# EAGLE board Beta24_mix (EAGLE 9.4.2)
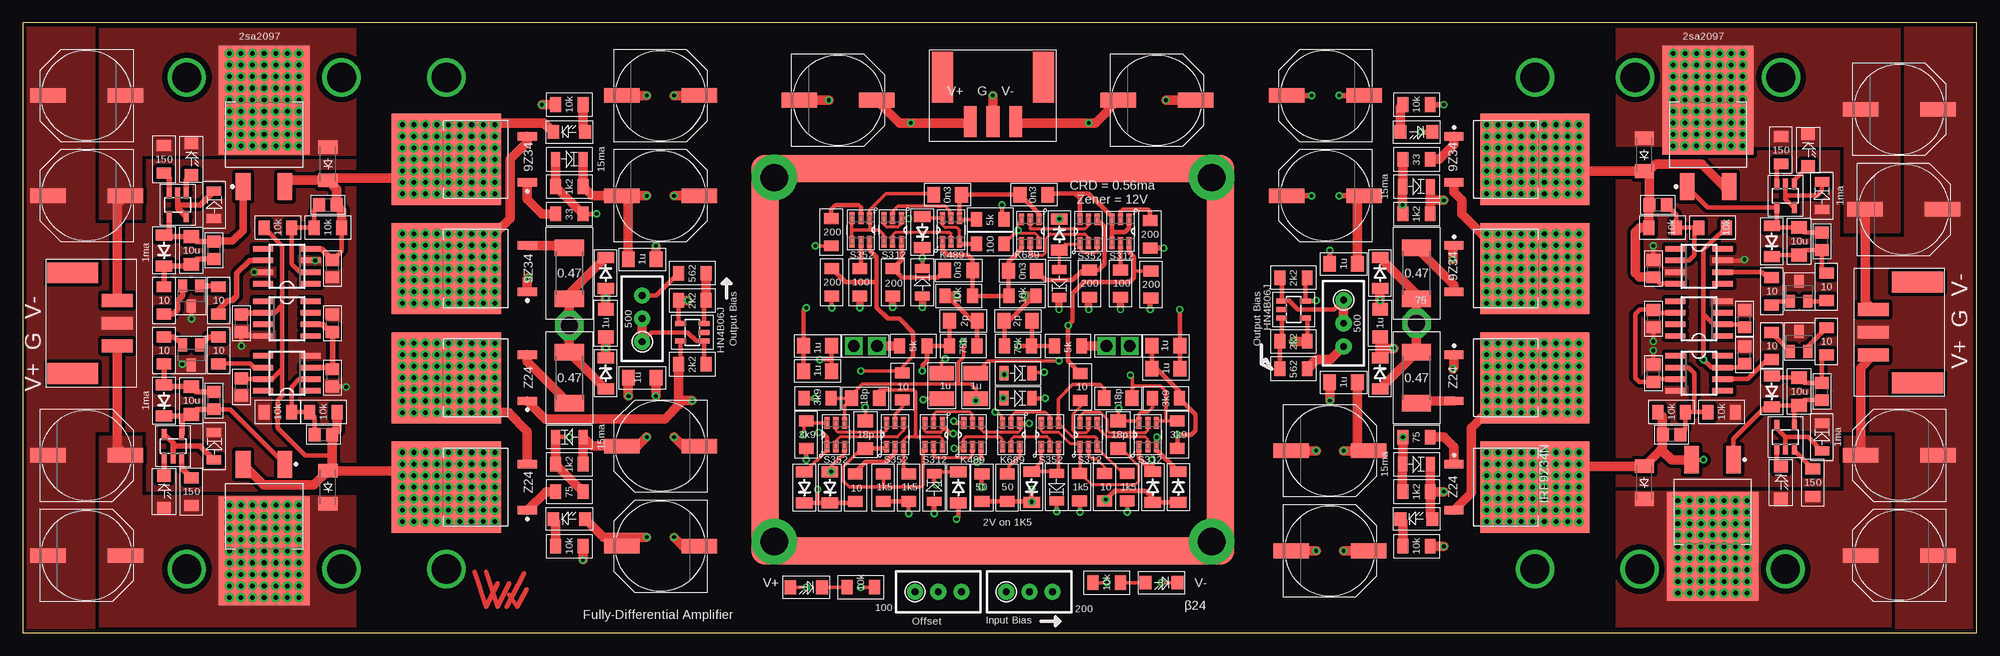
[diagram p2: board, top side]
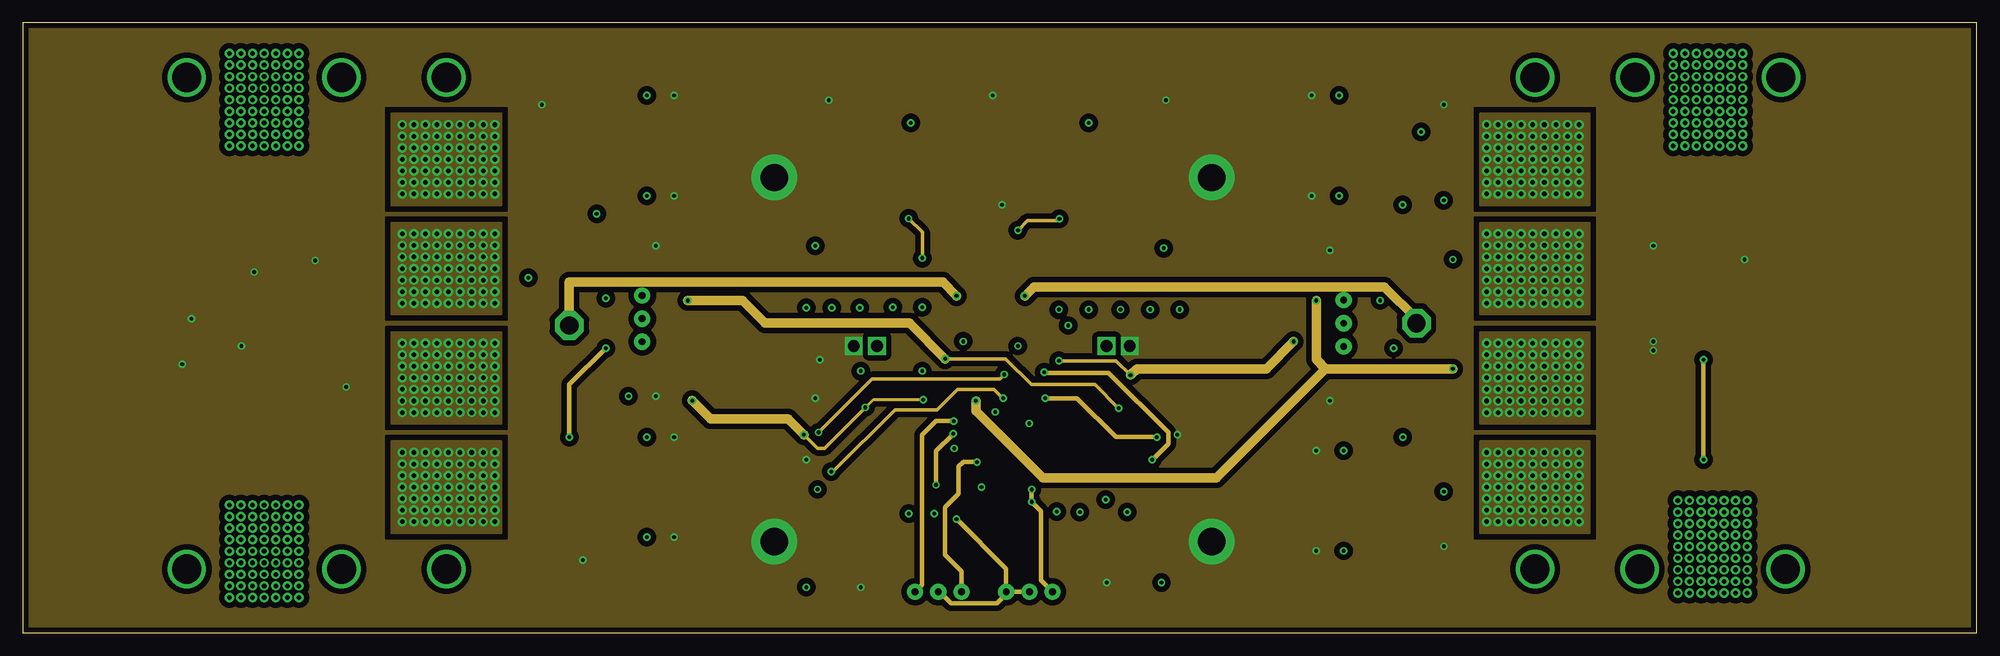
[diagram p3: board, inner layer Route2]
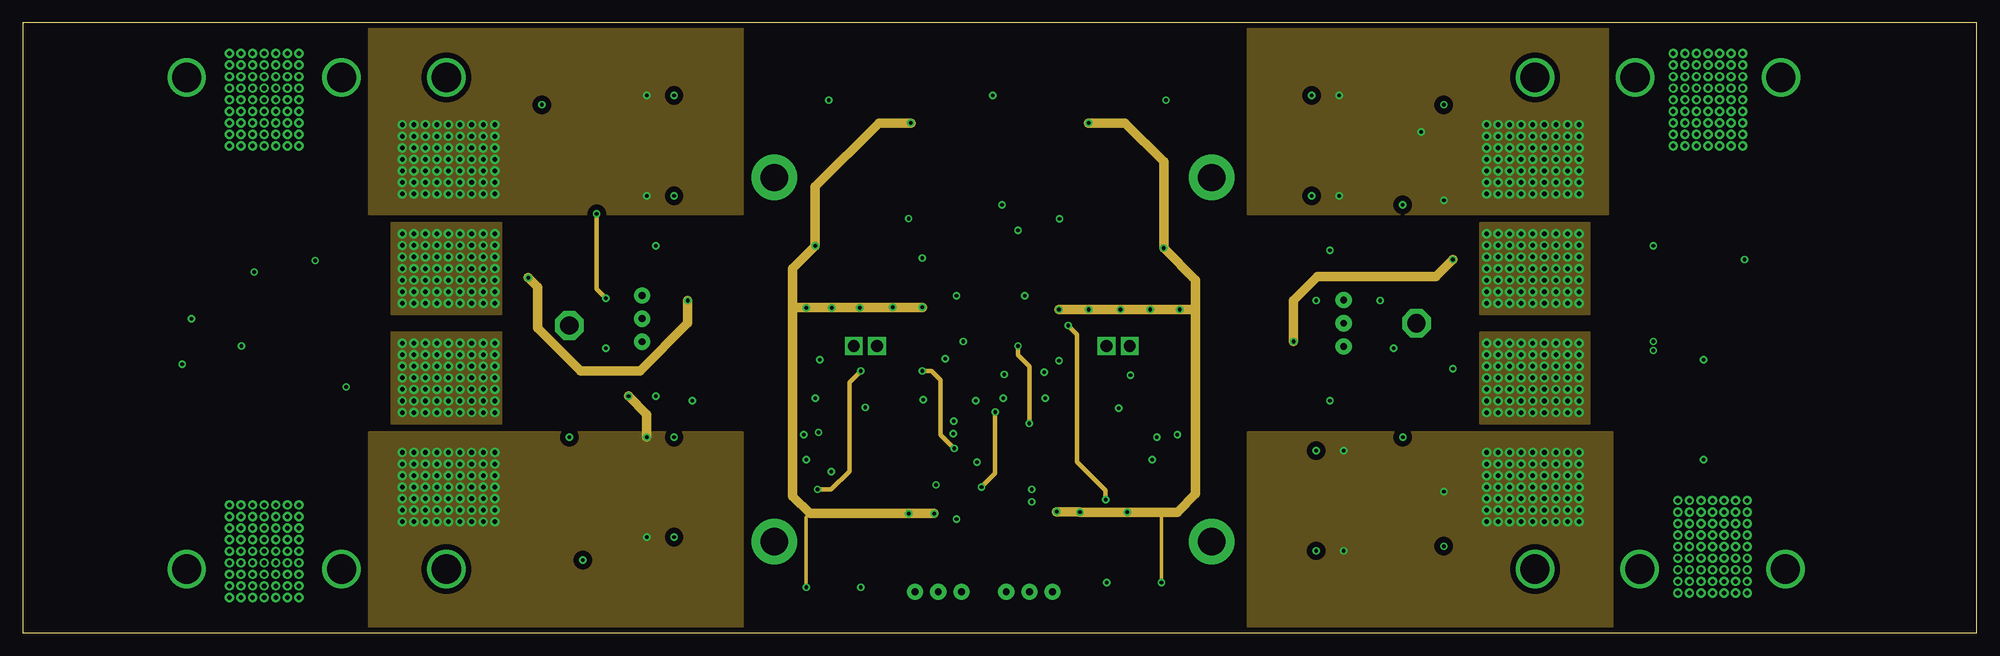
[diagram p4: board, inner layer Route15]
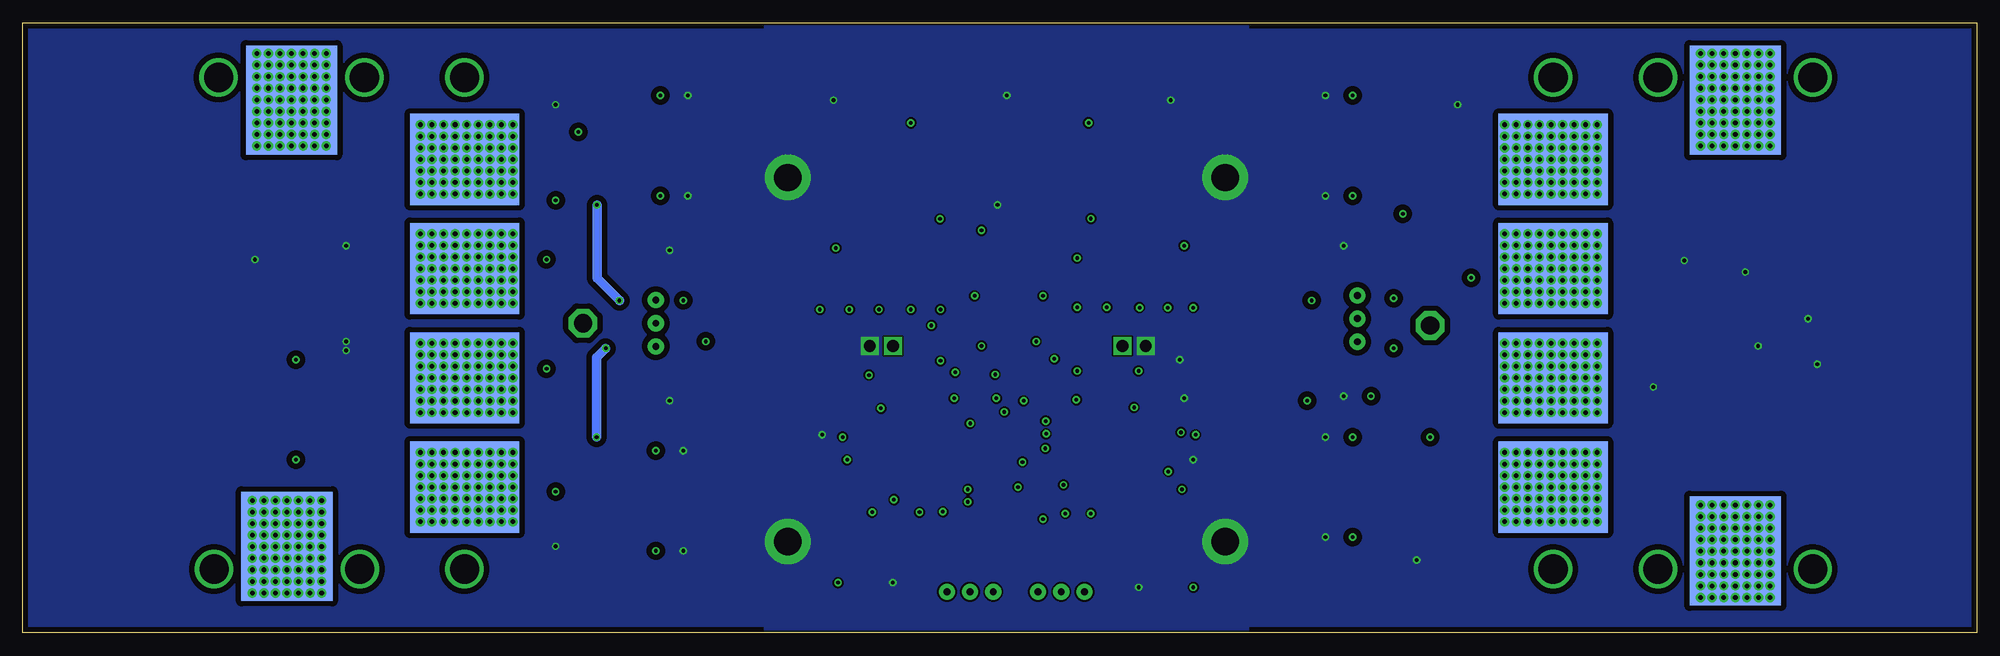
[diagram p5: board, bottom side, seen from below]

Size 214.5 x 67 mm. Coordinates in mm from the lower left corner, seen from the top.
Outline: 0,0 214.5,0 214.5,67 0,67 0,0
Copper layers (1+2*15+16): Top 0.035mm / dielectric 1.5mm / Route2 0.035mm / dielectric 0.15mm / Route15 0.035mm / dielectric 0.2mm / Bottom 0.035mm
Design rules "default *": minimum track width 10mil, minimum drill 0.4mm, track to track 8mil, track to pad 8mil, pad to pad 8mil, via to via 8mil, smd to smd 8mil, copper to edge 10mil, drill to drill 10mil, minimum pad ring 10mil, minimum via ring 8mil, stop-mask expansion 4mil, vias tented up to drill 0.4mm, thermal gap 15mil

## Footprints (pad centres in the part's own frame; a part is rotated, then mirrored left to right if it is on the bottom)
C1206 = smd 1.4 x 1.7: 1 -1.527,0; 2 1.527,0
C1210 = smd 1.6 x 2.7: 1 -1.4,0; 2 1.4,0
PANASONIC_G = smd 3.9 x 1.6: + 4.25,0; - -4.25,0
C0805 = smd 1.3 x 1.5: 1 -0.95,0; 2 0.95,0
SMD = smd 1 x 1.6: ANODE 1.525,0; CATHODE -1.525,0
SOD80C = smd 1.2 x 1.8: A 1.7,0; C -1.7,0
LED_SML1206 = smd 1.3 x 1.5: A 1.75,0; C -1.75,0
SOD-123_MINI-SMA = smd 1.5 x 2.1: A 1.8,0; C -1.8,0
SOIC8 = smd 0.6 x 2.2: 1 -1.905,-2.6; 2 -0.635,-2.6; 3 0.635,-2.6; 4 1.905,-2.6; 5 1.905,2.6; 6 0.635,2.6; 7 -0.635,2.6; 8 -1.905,2.6
TRANSISTOR_SOT23-BEC = smd 1 x 1.4: B -0.95,-1.1; C 0,1.1; E 0.95,-1.1
TO254P1054X240-3M = smd 2.108 x 0.925: 1 -8.887,2.54; 3 -8.887,-2.54 | smd 12 x 10 bottom: 2 0,0 | smd 12 x 10: 4 0,0 | drill 0.5 pad 1.016: P$1 -4.045,2.54; P$2 -2.775,2.54; P$3 -1.505,2.54; P$4 -0.235,2.54; P$5 1.035,2.54; P$6 2.305,2.54; P$7 3.575,2.54; P$8 3.575,1.27; P$9 2.305,1.27; P$10 -0.235,1.27; P$11 1.035,1.27; P$12 -1.505,1.27; P$13 -2.775,1.27; P$14 -4.045,1.27; P$15 -4.045,0; P$16 -2.775,0; P$17 -1.505,0; P$18 -0.235,0; P$19 1.035,0; P$20 2.305,0; P$21 3.575,0; P$22 3.575,-1.27; P$23 2.305,-1.27; P$24 1.035,-1.27; P$25 -0.235,-1.27; P$26 -1.505,-1.27; P$27 -2.775,-1.27; P$28 -4.045,-1.27; P$29 -4.045,-2.54; P$30 -2.775,-2.54; P$31 -1.505,-2.54; P$32 -0.235,-2.54; P$33 1.035,-2.54; P$34 2.305,-2.54; P$35 3.575,-2.54; P$36 3.575,-3.81; P$37 2.305,-3.81; P$38 1.035,-3.81; P$39 -0.235,-3.81; P$40 -2.775,-3.81; P$41 -4.045,-3.81; P$42 -1.505,-3.81; P$43 -4.045,3.81; P$44 -2.775,3.81; P$45 -1.505,3.81; P$46 -0.235,3.81; P$47 1.035,3.81; P$48 2.305,3.81; P$49 3.575,3.81; P$50 4.845,3.81; P$51 4.845,2.54; P$52 4.845,1.27; P$53 4.845,0; P$54 4.845,-1.27; P$55 4.845,-2.54; P$56 4.845,-3.81; P$57 -5.315,3.81; P$58 -5.315,2.54; P$59 -5.315,1.27; P$60 -5.315,0; P$61 -5.315,-1.27; P$62 -5.315,-2.54; P$63 -5.315,-3.81
MINI_MELF-0204W = smd 1.2 x 1.6: 1 -1.5,0; 2 1.5,0
R2512 = smd 1.8 x 3.2: 1 -2.8,0; 2 2.8,0
B24J = drill 1.3 square: P$1 -1.27,0; P$2 1.27,0
P1-20 = drill 2.007 pad 3.15 octagon: TP 0,0
SOT-23-6 = smd 1.27 x 0.559: 1 -1.295,0.95; 2 -1.295,0; 3 -1.295,-0.95; 4 1.295,-0.95; 5 1.295,0; 6 1.295,0.95
SOT25 = smd 0.55 x 1.2: 1 -0.95,-1.3; 2 0,-1.3; 3 0.95,-1.3; 4 0.95,1.3; 5 -0.95,1.3
B24C = drill 3 pad 5: P$1 -24,20; P$2 24,20; P$3 24,-20; P$4 -24,-20 | smd 53 x 3: P$5 0,21; P$6 0,-21 | smd 3 x 45: P$7 -25,0; P$8 25,0
CON-PTSM-3 = smd 2.3 x 5.6: P$1 -5.54,0; P$2 5.54,0 | smd 1.4 x 3.4: P$3 -2.5,-4.85; P$4 0,-4.85; P$5 2.5,-4.85
NEW-PWMOLD = smd 3 x 1.6: 1 0.003,2.3; 3 0.003,-2.3 | smd 12 x 10 bottom: 2 9.5,0 | smd 12 x 10: 4 9.5,0 | drill 0.5 pad 1.016: P$1 5.734,2.54; P$2 7.004,2.54; P$3 8.274,2.54; P$4 9.544,2.54; P$5 10.814,2.54; P$6 12.084,2.54; P$7 13.354,2.54; P$8 13.354,1.27; P$9 12.084,1.27; P$10 9.544,1.27; P$11 10.814,1.27; P$12 8.274,1.27; P$13 7.004,1.27; P$14 5.734,1.27; P$15 5.734,0; P$16 7.004,0; P$17 8.274,0; P$18 9.544,0; P$19 10.814,0; P$20 12.084,0; P$21 13.354,0; P$22 13.354,-1.27; P$23 12.084,-1.27; P$24 10.814,-1.27; P$25 9.544,-1.27; P$26 8.274,-1.27; P$27 7.004,-1.27; P$28 5.734,-1.27; P$29 5.734,-2.54; P$30 7.004,-2.54; P$31 8.274,-2.54; P$32 9.544,-2.54; P$33 10.814,-2.54; P$34 12.084,-2.54; P$35 13.354,-2.54; P$36 13.354,-3.81; P$37 12.084,-3.81; P$38 10.814,-3.81; P$39 9.544,-3.81; P$40 7.004,-3.81; P$41 5.734,-3.81; P$42 8.274,-3.81; P$43 5.734,3.81; P$44 7.004,3.81; P$45 8.274,3.81; P$46 9.544,3.81; P$47 10.814,3.81; P$48 12.084,3.81; P$49 13.354,3.81; P$50 14.624,3.81; P$51 14.624,2.54; P$52 14.624,1.27; P$53 14.624,0; P$54 14.624,-1.27; P$55 14.624,-2.54; P$56 14.624,-3.81; P$57 4.464,3.81; P$58 4.464,2.54; P$59 4.464,1.27; P$60 4.464,0; P$61 4.464,-1.27; P$62 4.464,-2.54; P$63 4.464,-3.81
RTRIM3296W = drill 0.75 pad 1.778: 1 0,-2.54; 2 0,0; 3 0,2.54

## Placement (x,y rotation side)
C1  330p  [C1206]  102.75,39.8 180 top
C2  [C1206]  92.5,25.75 0 top
C3  [C1206]  92.5,21.75 270 top
C4  [C1206]  120.25,25.75 180 top
C5  [C1206]  120.25,21.75 270 top
C6  1u  [C1210]  104.62,27.12 90 top
C7  1u  [C1210]  100.88,27.12 90 top
C8  1u  [C1206]  64,34 90 top
C9  1u  [C1206]  149,34 90 top
C10  330p  [C1206]  101.53,48.12 180 top
C11  330p  [C1206]  109.75,39.75 180 top
C12  330p  [C1206]  111,48.12 180 top
C13  [C1206]  103.25,34.25 0 top
C14  [C1206]  109.25,34.25 180 top
C15  [C1206]  87.25,28.75 0 top
C16  [C1206]  87.25,31.5 0 top
C17  [C1206]  125.5,29 0 top
C18  [C1206]  125.5,31.5 0 top
C19  [PANASONIC_G]  124.5,58.5 0 top
C20  [PANASONIC_G]  89.5,58.5 0 top
C21  [PANASONIC_G]  70,9.5 180 top
C22  [PANASONIC_G]  70,59 0 top
C23  [PANASONIC_G]  70,20.5 180 top
C24  [PANASONIC_G]  70,48 0 top
C25  [C1206]  145,27.5 180 top
C26  [C1206]  145,40.5 0 top
C27  [C1206]  68,28 0 top
C28  [C1206]  68,41 180 top
C30  [PANASONIC_G]  143.5,9 0 top
C31  [PANASONIC_G]  143,48 180 top
C32  [PANASONIC_G]  143.5,20 0 top
C33  [PANASONIC_G]  143,59 180 top
C64  [C0805]  21,25.5 90 top
C65  47uF  [C1206]  18.5,25.5 90 top
C66  47uF  [C1206]  18.5,42 90 top
C67  [C0805]  21,42 90 top
C70  [C0805]  33,21.75 180 top
C71  [C0805]  33.5,47 0 top
C72  [C0805]  24,34 270 top
C73  [C0805]  34,28 270 top
C84  [PANASONIC_G]  7,8.5 0 top
C85  [PANASONIC_G]  7,59 180 top
C86  [PANASONIC_G]  7,19.5 0 top
C87  [PANASONIC_G]  7,48 180 top
C88  [C0805]  197.5,26.5 90 top
C89  47uF  [C1206]  195,26.5 90 top
C90  47uF  [C1206]  195,43 90 top
C91  [C0805]  197.5,43 90 top
C92  [C0805]  34,40 90 top
C93  [C0805]  34,34 90 top
C94  [C0805]  24,27 270 top
C97  [C0805]  181,21.75 0 top
C98  [C0805]  179.5,47 180 top
C99  [C0805]  189,34.5 90 top
C100  [C0805]  179,28.5 90 top
C111  [PANASONIC_G]  206,8.5 180 top
C112  [PANASONIC_G]  206,57.5 0 top
C113  [PANASONIC_G]  206,19.5 180 top
C114  [PANASONIC_G]  206.5,46.5 0 top
C119  [C0805]  179,40 270 top
C120  [C0805]  179,34.5 270 top
C121  [C0805]  189,30.5 90 top
CR1  1N5283  [SMD]  100.05,15.95 270 top
CR2  1N5283  [SMD]  113.5,16 90 top
CR3  1N5283  [SMD]  98.75,38.5 270 top
CR4  1N5283  [SMD]  113.8,38.35 90 top
CR5  1N5283  [SMD]  109.25,25.75 180 top
CR6  1N5283  [SMD]  109.25,28.5 180 top
CR7  1N5283  [SMD]  153,18.5 180 top
CR8  1N5283  [SMD]  153,49 180 top
CR9  1N5283  [SMD]  60,52 180 top
CR10  1N5283  [SMD]  60,21.5 0 top
D1  [SOD80C]  102.7,15.95 270 top
D2  [SOD80C]  110.75,16 90 top
D3  [SOD80C]  149,28.5 270 top
D4  [SOD80C]  149,39.5 270 top
D5  [SOD80C]  88.6,15.95 90 top
D6  [SOD80C]  85.8,15.95 90 top
D7  [SOD80C]  126.85,16 270 top
D8  [SOD80C]  124.05,16 270 top
D9  [SOD80C]  64,28.5 270 top
D10  [SOD80C]  64,39.5 270 top
D11  [SOD80C]  98.75,44 90 top
D12  [SOD80C]  113.8,43.75 270 top
D20  [LED_SML1206]  15.5,15.5 270 top
D21  [LED_SML1206]  18.5,52 270 top
D22  TZMC10  [SOD80C]  15.5,25.5 90 top
D23  TZAMC10  [SOD80C]  15.5,42 90 top
D24  CGRM4004-G  [SOD-123_MINI-SMA]  33.5,51.5 90 top
D25  CGRM4004-G  [SOD-123_MINI-SMA]  33.5,16 90 top
D27  [LED_SML1206]  193,16.5 270 top
D28  [LED_SML1206]  196,53 270 top
D29  TZMC10  [SOD80C]  192,26.5 90 top
D30  TZAMC10  [SOD80C]  192,43 90 top
D31  CGRM4004-G  [SOD-123_MINI-SMA]  178,52.5 90 top
D32  CGRM4004-G  [SOD-123_MINI-SMA]  178,16.5 90 top
IC4  LT1021S  [SOIC8]  29,34.5 270 top
IC5  LT1037CS8  [SOIC8]  29,28.5 90 top
IC6  LT1037CS8  [SOIC8]  29,40.25 90 top
IC7  LT1021S  [SOIC8]  184,34.5 90 top
IC8  LT1037CS8  [SOIC8]  184,28.5 270 top
IC9  LT1037CS8  [SOIC8]  184,40.25 270 top
LED1  [LED_SML1206]  60,12.5 0 top
LED2  [LED_SML1206]  60,55 0 top
LED3  [LED_SML1206]  153,12.5 0 top
LED4  [LED_SML1206]  153,55 180 top
LED5  [LED_SML1206]  86,5 180 top
LED6  [LED_SML1206]  125,5.5 180 top
Q1  [TRANSISTOR_SOT23-BEC]  18.5,30.5 180 top
Q2  [TRANSISTOR_SOT23-BEC]  18.5,37 180 top
Q3  [TRANSISTOR_SOT23-BEC]  195,32 0 top
Q4  [TRANSISTOR_SOT23-BEC]  195,37.5 0 top
Q21  IRFZ24ND2PAK  [TO254P1054X240-3M]  46.5,28 180 top
Q22  IRF9Z34D2PAK  [TO254P1054X240-3M]  46.5,40 180 top
Q23  IRFZ24ND2PAK  [TO254P1054X240-3M]  46.5,16 180 top
Q24  IRF9Z34D2PAK  [TO254P1054X240-3M]  46.5,52 180 top
Q25  IRFZ24ND2PAK  [TO254P1054X240-3M]  166,28 0 top
Q26  IRF9Z34D2PAK  [TO254P1054X240-3M]  166,40 0 top
Q27  IRFZ24ND2PAK  [TO254P1054X240-3M]  166,16 0 top
Q28  IRF9Z34D2PAK  [TO254P1054X240-3M]  166,52 0 top
R1  [MINI_MELF-0204W]  139.5,39 0 top
R2  [MINI_MELF-0204W]  139.5,32 180 top
R3  10k  [MINI_MELF-0204W]  109.75,37 180 top
R4  10k  [MINI_MELF-0204W]  102.75,37 180 top
R5  [MINI_MELF-0204W]  139.5,29 0 top
R6  [MINI_MELF-0204W]  153,15.5 0 top
R7  [MINI_MELF-0204W]  108.05,15.95 90 top
R8  [MINI_MELF-0204W]  105.3,15.95 270 top
R9  [MINI_MELF-0204W]  97.25,15.95 90 top
R10  [MINI_MELF-0204W]  94.45,15.95 90 top
R11  [MINI_MELF-0204W]  121.25,16 270 top
R12  [MINI_MELF-0204W]  116,16 270 top
R13  [MINI_MELF-0204W]  153,46 0 top
R14  200  [MINI_MELF-0204W]  88.8,38.5 90 top
R15  200  [MINI_MELF-0204W]  123.85,38.25 270 top
R16  10  [MINI_MELF-0204W]  91.4,15.95 270 top
R17  10  [MINI_MELF-0204W]  96.55,27.05 270 top
R18  10  [MINI_MELF-0204W]  118.75,16 270 top
R19  10  [MINI_MELF-0204W]  116.1,27 270 top
R20  [MINI_MELF-0204W]  87.25,25.75 0 top
R21  [MINI_MELF-0204W]  126.75,21.75 270 top
R22  [MINI_MELF-0204W]  153,21.5 180 top
R23  [MINI_MELF-0204W]  86,21.75 90 top
R24  [MINI_MELF-0204W]  125.5,25.75 0 top
R25  [MINI_MELF-0204W]  73.5,29.5 180 top
R26  [MINI_MELF-0204W]  73.5,36.5 0 top
R27  [MINI_MELF-0204W]  73.5,39.5 180 top
R28  [MINI_MELF-0204W]  60,18.5 0 top
R29  [MINI_MELF-0204W]  60,49 0 top
R30  [MINI_MELF-0204W]  153,52 180 top
R31  0.47  [R2512]  153,28 90 top
R32  [MINI_MELF-0204W]  60,15.5 0 top
R33  [MINI_MELF-0204W]  60,46 0 top
R34  0.47  [R2512]  60,28 90 top
R35  0.47  [R2512]  60,39.5 90 top
R36  0.47  [R2512]  153,39.5 90 top
R37  200  [MINI_MELF-0204W]  95.5,38.5 90 top
R38  200  [MINI_MELF-0204W]  88.75,44 90 top
R39  200  [MINI_MELF-0204W]  117.1,38.35 270 top
R40  200  [MINI_MELF-0204W]  123.75,43.75 270 top
R41  5k  [MINI_MELF-0204W]  106.2,45.4 0 top
R42  [MINI_MELF-0204W]  91.9,38.5 90 top
R43  100  [MINI_MELF-0204W]  106.2,42.7 0 top
R44  [MINI_MELF-0204W]  120.5,38.35 270 top
R45  [MINI_MELF-0204W]  97.75,31.5 180 top
R46  [MINI_MELF-0204W]  114.75,31.5 0 top
R47  [MINI_MELF-0204W]  103.25,31.5 180 top
R48  [MINI_MELF-0204W]  109.25,31.5 0 top
R49  [MINI_MELF-0204W]  153,9.5 180 top
R50  [MINI_MELF-0204W]  153,58 0 top
R51  200  [MINI_MELF-0204W]  92,5 0 top
R52  [MINI_MELF-0204W]  119,5.5 180 top
R53  [MINI_MELF-0204W]  60,9.5 180 top
R54  [MINI_MELF-0204W]  60,58 180 top
R67  150  [MINI_MELF-0204W]  18.5,15.5 90 top
R68  10  [MINI_MELF-0204W]  15.5,31 90 top
R69  150  [MINI_MELF-0204W]  15.5,52 90 top
R70  10  [MINI_MELF-0204W]  15.5,36.5 90 top
R71  10  [MINI_MELF-0204W]  21.5,36.5 90 top
R72  10  [MINI_MELF-0204W]  21.5,31 90 top
R73  R2  [MINI_MELF-0204W]  28,24.25 0 top
R74  R1  [MINI_MELF-0204W]  33,24.25 0 top
R75  R11  [MINI_MELF-0204W]  33.5,44.5 180 top
R76  R12  [MINI_MELF-0204W]  28,44.5 180 top
R79  150  [MINI_MELF-0204W]  196.5,16.5 90 top
R80  10  [MINI_MELF-0204W]  198,32 90 top
R81  150  [MINI_MELF-0204W]  193,53 90 top
R82  10  [MINI_MELF-0204W]  198,38 90 top
R83  10  [MINI_MELF-0204W]  192,37.5 270 top
R84  10  [MINI_MELF-0204W]  192,31.5 90 top
R85  R2  [MINI_MELF-0204W]  186.5,24.25 180 top
R86  R1  [MINI_MELF-0204W]  181,24.25 180 top
R87  R11  [MINI_MELF-0204W]  180,44.5 0 top
R88  R12  [MINI_MELF-0204W]  185.5,44.5 0 top
SJ1  B24JUMPER  [B24J]  92.5,31.5 180 top
SJ2  B24JUMPER  [B24J]  120.25,31.5 0 top
TP1  PTR1PAD1-20  [P1-20]  60,33.75 0 top
TP2  PTR1PAD1-20  [P1-20]  153,34 0 top
U$1  LSK489SOP-6  [SOT-23-6]  104.25,21.75 90 top
U$2  LS3250  [SOT-23-6]  100,21.75 270 top
U$3  LSK489SOP-6  [SOT-23-6]  101.9,44.25 90 top
U$4  NPN_PNP_CE  [SOT25]  73.5,33 90 top
U$5  LSK689  [SOT-23-6]  108.5,21.75 270 top
U$6  LS3250  [SOT-23-6]  95.5,44.25 270 top
U$7  LS3250  [SOT-23-6]  117,21.75 90 top
U$8  LS3250  [SOT-23-6]  123.5,21.75 90 top
U$9  LS3550  [SOT-23-6]  117,44.1 90 top
U$10  LS3550  [SOT-23-6]  112.75,21.75 90 top
U$11  LS3550  [SOT-23-6]  95.75,21.75 90 top
U$12  LS3550  [SOT-23-6]  89.25,21.75 90 top
U$13  LS3250  [SOT-23-6]  120.5,44.1 270 top
U$14  LS3550  [SOT-23-6]  92,44.25 270 top
U$15  LSK689  [SOT-23-6]  110.6,44.1 270 top
U$16  NPN_PNP_CE  [SOT25]  139.5,35.5 270 top
U$17  VWV  [VWV]  52.12,2.88 0 top
U$18  B24C  [B24C]  106.5,30 0 top
U$19  CON-PTSM-3  [CON-PTSM-3]  106.5,61 0 top
U$27  2SC5886  [NEW-PWMOLD]  26.5,18.5 270 top
U$28  2SA2097  [NEW-PWMOLD]  26.5,49 90 top
U$29  1N5283  [SMD]  21,20.5 270 top
U$30  1N5283  [SMD]  21,47 270 top
U$31  NPN_DUAL_CBSOT-25-5  [SOT25]  17,47 180 top
U$32  PNP_DUAL_CB  [SOT25]  16.5,20.5 0 top
U$33  CON-PTSM-3  [CON-PTSM-3]  5.5,34 90 top
U$35  2SC5886  [NEW-PWMOLD]  185.5,19 270 top
U$36  2SA2097  [NEW-PWMOLD]  185,49 90 top
U$37  1N5283  [SMD]  197.5,21.5 270 top
U$38  1N5283  [SMD]  197.5,48 270 top
U$39  NPN_DUAL_CBSOT-25-5  [SOT25]  193.5,48 180 top
U$40  PNP_DUAL_CB  [SOT25]  193.5,21.5 0 top
U$41  CON-PTSM-3  [CON-PTSM-3]  208,33 270 top
VR1  200  [RTRIM3296W]  110.5,4.5 270 top
VR2  500  [RTRIM3296W]  145,34 180 top
VR3  500  [RTRIM3296W]  68,34.5 0 top
VR4  100  [RTRIM3296W]  100.5,4.5 270 top

## Tracks (layer width: path | path; a pad name or v marks a point on that pad's centre or on a via)
C+  (via drill 0.4)
  Top 0.406: 97.75,30.38 96.55,29.18 R17.1 96.35,28.75 v92,28.75
  Top 0.508: U$14.6 92.95,42.05 93.75,41.25 93.75,38.5 | R16.2 91.2,14.25 D5.C 87.5,14.25 | 87.5,14.25 D6.C | 97.75,30.38 97.75,33 96.25,34.5 95,34.5 93.75,35.75 93.75,38.5 | R14.2 90.3,38.5 93.75,38.5 | 87.5,14.25 87.25,14.5 v87.25,15.75
  Route15 0.508: v87.25,15.75 88.75,15.75 90.75,17.75 90.75,27.5 v92,28.75
C-  (via drill 0.4)
  Top 0.406: R15.1 122,39.75
  Top 0.508: D7.A D8.A 124.05,14.8 123.25,15.6 119.85,15.6 v118.88,14.62 R18.2 | R19.1 114.75,29.85 v114.75,33.75 115.25,34.25 115.25,37.25 116.5,38.5 121.5,38.5 122,39 122,39.75 122,41.25 121.45,41.8 U$13.6
  Route15 0.508: v114.75,33.75 115.75,32.75 115.75,18.75 118.88,15.62 v118.88,14.62
GND  (via drill 0.4)
  Top 0.406: R52.2 v119,5.5 | R51.2 v92,5
  Top 0.508: R23.1 v86,19 | R20.1 v87,25.75 | R21.2 v126.75,21.75 128.25,21.75 128.75,22.25 128.75,24 R24.2 127,26.5 124.5,29 C17.1 C18.1 | C15.2 88.78,30 | 88.78,30 C16.2 | 88.78,30 v87.5,30 | R41.2 107.5,45.6 v107.5,47 | Q2.C v18.5,34.5 | Q1.C 18.4,29.5 v17.5,29.5 | v24,31.5 C72.2 24.45,33.05 24.91,32.59 IC4.4 | C73.2 35.45,27.05 v35.5,27 | C120.2 v179,32 | C100.2 v179,31 | IC9.7 188.88,40.88 v189,41 | C119.1 v179,42.5
  Top 0.61: C26.1 143.47,41.97 v143.5,42 | C31.+ v141.5,48 | C33.+ v141.5,59 | R50.2 v156,58
  Top 1.016: U$18.P$5 83,51 82.5,51.5 U$18.P$1 | C19.+ v125.5,58.5 | C20.- v88.5,58.5 | U$18.P$8 131.5,10.5 130.5,9.5 | 130.5,9.5 U$18.P$3 | U$18.P$7 82.5,29 U$18.P$4 | U$18.P$6 130,9 130.5,9.5 | U$19.P$4 v106.5,59 | C32.- v142,20 | C25.2 143.47,25.53 v143.5,25.5 | R49.1 v156,9.5 | C30.- v142,9 | C23.- 72.5,20.5 v71.5,21.5 | C21.- 72.5,9.5 v71.5,10.5 | C27.2 69.53,26.03 v69.5,26 | C28.1 69.5,41.03 v69.5,42.5 | C22.+ v71.5,59 | C24.+ v71.5,48 | R54.2 v57,58 | R53.1 v61.5,8
  other vias: 25.4,39.62 32.1,40.88
  pour Route2 (isolate 0.61, rank 2, no thermals): -5,71.12 218.5,71.12 218.5,-2 -5,-2
  pour Bottom (no thermals): 80,66.62 133,66.62 133,-2 80,-2
  pour Top (isolate 0.406, rank 2, no thermals): 175,68 175,-1.5 216,-1.5 216,68
  pour Bottom (isolate 0.61, rank 2, no thermals): -5,76 224,76 224,-2 -5,-2 -5,-2
  pour Top (isolate 0.406, rank 2, no thermals): -3.5,67.5 36.5,67.5 36.5,-0.5 -3.5,-0.5
IN+  (via drill 0.4)
  Top 0.305: U$5.4 107.5,20.5 107.5,21.25 107.25,21.5 103.5,21.5 103.25,21.25 103.25,20.5 U$1.1
  Top 0.508: C13.1 101.72,31.53 R47.2 R45.1 99.25,29.88 98.75,29.38 v98.75,28.75 | U$1.1 103.09,20.25 v102.25,20.25
  Route15 0.508: v102.25,20.25 100.75,21.75 100.75,27.75 99.75,28.75 v98.75,28.75
IN-  (via drill 0.4)
  Top 0.305: U$5.1 109.45,22.2 109.25,22 107.47,22 107.46,22.01 105.5,22.01 105.2,22.31 U$1.4
  Top 0.508: C14.1 110.78,31.53 | 110.78,31.53 R48.2 | R46.1 110.8,31.5 | 110.8,31.5 110.78,31.53 | 110.8,31.5 v109.25,31.5 | v110.5,23 109.5,23 U$5.1
  Route15 0.508: v109.25,31.5 109.25,30.5 110.5,29.25 v110.5,23
N$1
  Top 0.508: U$13.4 119.55,44 | 115.53,48.25 117,48.25 119.55,45.7 U$13.3 119.55,44 | U$13.1 121.45,44.45 121,44 119.55,44 | U$9.6 116.05,47.73 115.53,48.25 | 115.53,48.25 112.65,48.25 C12.1
N$2
  Top 0.305: U$1.5 104.25,24 104,24.25 100.25,24.25 100,24 U$2.2
N$3  (via drill 0.4)
  Top 0.508: v104.75,18.75 105.2,19.2 U$1.3
  Route2 0.508: VR4.3 103.04,6.75 101.25,8.54 101.25,13.75 102.75,15.25 102.75,18.25 103.25,18.75 v104.75,18.75
N$4
  Top 0.406: R7.2 108.25,17.65 108.25,18.25 109.45,19.45 U$5.6
N$5
  Top 0.305: U$2.5 100,19.5 100.25,19.25 104,19.25 104.25,19.5 U$1.2
N$6
  Top 0.305: U$10.2 112.75,21.25 112.5,21.5 109.47,21.5 109.46,21.49 108.74,21.49 108.5,21.25 U$5.5
N$7  (via drill 0.4)
  Top 0.508: v102.2,23.25 102.41,23.05 U$1.6
  Route2 0.508: VR4.1 98.71,5.25 98.71,21.71 100.25,23.25 v102.2,23.25
N$8  (via drill 0.4)
  Top 0.508: R8.2 R7.1 110.6,14.45 D2.C v110.75,14.38 v110.75,15.75
  Route2 0.508: v110.75,15.75 v110.75,14.38 111.79,13.34 111.79,5.75 VR1.3
N$9  (via drill 0.4)
  Top 0.305: U$5.3 107.55,23.7 107,24.25 v106.75,24.25
  Top 0.508: v105.25,16 105.25,17.4 R8.1
  Route15 0.508: v105.25,16 106.75,17.5 v106.75,24.25
N$10
  Top 0.305: U$5.2 108.5,23.75 109,24.25 112.25,24.25 112.75,23.75 U$10.5
N$11  (via drill 0.4)
  Top 0.508: D1.A 102.7,12.7 v102.5,12.5
  Route2 0.508: v102.5,12.5 107.96,7.04 VR1.1 | VR1.2 VR1.1 | VR1.1 107.96,4.25 106.96,3.25 101.88,3.25 100.62,4.5 VR4.2
N$12
  Top 0.406: U$10.1 111.8,18.75 D2.A 113.33,17.7 | 113.33,17.7 CR2.ANODE | U$10.3 113.7,18.07 113.33,17.7
N$13
  Top 0.305: U$2.6 100.95,21.3 100.76,21.49 98.26,21.49 98.25,21.5 98,21.5 97,21.5 96.7,21.2 U$11.3
  Top 0.406: R9.2 97.25,17.65 96.7,18.2 U$11.3 | C2.2 94.03,26.65 97.85,26.65 98,26.5 98,21.5
N$14
  Top 0.406: C3.2 92.05,20.22 90.05,18.22 90.05,16.7 90.75,16 94.5,16 | U$2.4 98.8,20.2 98.8,16.25 98.55,16 94.5,16 | R10.2 94.5,17.4 94.5,16
  Top 0.508: U$11.1 94.57,20.22 C3.2
N$15  (via drill 0.4)
  Top 0.406: U$12.6 86.2,23.05 R23.2 85.75,23 v85.75,21.75 | C3.1 v92.5,24.75 | C7.1 98.97,25.73 v98.85,25.6
  Top 0.508: U$4.5 72.2,29.7 R25.2
  Top 1.016: Q21.1 57.35,23.5 70.5,23.5 72,25 | 72,25 R25.2 | 72,25 72.5,25.5 v73.5,25.5
  Route2 0.305: v98.85,25.6 93.35,25.6 v92.5,24.75
  Route2 0.406: v85.75,21.75 87.25,20.25 88,20.25 v92.5,24.75
  Route2 1.016: v73.5,25.5 75.5,23.5 84,23.5 v85.75,21.75
N$16  (via drill 0.4)
  Top 0.305: U$2.1 100.95,22.75 100.95,22.2 100.75,22 99.25,22 99,22.25 99,23 U$2.3
  Top 0.406: CR1.CATHODE 100.22,17.65 D1.C
  Top 0.508: v100.25,16.25 100.05,16.45 CR1.CATHODE | v102.16,21.86 101.84,21.86 100.95,22.75
  Route2 0.508: v100.25,16.25 100.25,19.95 v102.16,21.86
N$17
  Top 0.508: R40.1 123.75,46.25 123.5,46.5 120.75,46.5 120.5,46.25 U$13.2
N$18
  Top 0.305: U$10.6 111.8,22.2 111.99,22.01 113.74,22.01 115,20.75 115.75,20.75 U$7.1 116.05,17.8 115.9,17.65 115.9,17.4 R12.1 116.2,17.3 116.3,17.3 117.35,16.25 122.1,16.25 122.49,16.64 122.49,18.33 120.6,20.22 C5.2
N$19
  Top 0.508: U$3.1 100.95,42.05 101.5,41.5 103.75,41.5 104.28,40.97 C1.1 104.25,39.77 R4.1 R3.2 108.22,37.03 C11.2 108.22,40.72 109.65,42.15 U$15.4
N$20  (via drill 0.4)
  Top 0.508: R33.2 v63,46
  Top 1.016: CR9.ANODE 58.48,49.02 R29.1 R33.2 | C8.2 v64,36.75 D10.A
  Route15 0.508: v63,46 63,37.75 v64,36.75
N$21  (via drill 0.4)
  Top 0.305: U$15.3 109.25,44.99 v109.25,44.2 109.6,43.85 111.15,43.85 111.55,43.45 U$15.6
  Top 0.406: R43.2 109.2,44.2 v109.25,44.2
  Route2 0.406: v109.25,44.2 110.3,45.25 113.75,45.25 113.8,45.3 D12.C
  other vias: 113.8,45.45
N$22
  Top 0.305: U$3.3 102.85,44.2 102.55,44.5 101.25,44.5 100.95,44.8 U$3.6
  Top 0.406: U$3.6 98.91,45.55 D11.A
  Top 0.508: R43.1 103.11,42.7 U$3.3
N$23
  Top 0.305: U$11.6 94.8,22.3 94.51,22.01 89.5,22.01 89.25,22.26 U$12.5
N$24
  Top 0.305: R11.1 120.75,17.5 117.95,20.3 U$7.3 117.95,21.3 117.75,21.5 116.97,21.5 116.96,21.49 115.26,21.49 U$10.4
  Top 0.406: C4.2 118.72,26.78 118.25,27.25 115.25,27.25 113.7,25.7 U$10.4
N$25
  Top 0.305: U$11.4 96.7,22.2 96,21.5 89.7,21.5 89.25,21.05 U$12.2
N$26
  Top 0.508: R38.2 88.75,46.5 89.25,47 91.75,47 92,46.75 U$14.2
N$27
  Top 0.508: U$11.2 95.75,19.75 94.75,18.75 92.5,18.75 91.4,17.65 R16.1
N$28
  Top 0.406: U$11.5 95.75,24 96.55,24.8 R17.2
N$29
  Top 0.406: C10.2 99.87,48.25 94.75,48.25 92.95,46.45 U$14.1 93,45.49 93,44.25 | U$6.4 94.5,43.01 94.5,43.75 94,44.25 93,44.25 | 91,44.25 91,45.59 U$14.3 | 93,44.25 91,44.25 | U$14.4 91,43.01 91,44.25
N$30
  Top 0.305: U$7.2 117,19.5 117.4,19.1 117.85,19.1 118.75,18.2 R18.1
N$31
  Top 0.305: R19.2 116.64,25.39 115.25,24 115.25,22.25 115.5,22 116.75,22 117,22.25 U$7.5
N$32
  Top 1.016: R45.2 SJ1.P$1
N$33
  Top 0.406: U$3.5 101.74,45.71 101.74,46.35 101.24,46.84 96.09,46.84 95.5,46.25 U$6.2
N$34
  Top 0.305: CR4.ANODE D12.A 114.45,42.7 116,42.7 | U$9.1 116,42.8 116,42.7 | U$9.3 117.95,41.95 117.71,41.71 116.57,41.71 116.54,41.75 116.5,41.75 116,42.25 116,42.7
N$35  (via drill 0.4)
  Top 0.406: C2.1 90.97,26.12 92.17,27.32 102.75,27.32 | R20.2 C2.1 | U$12.4 90.2,24.98 C2.1 | v104.62,25.48 104.62,26 104.62,26.75 104.06,27.32 102.75,27.32 | v103.25,32 103.25,30.25 102.75,29.75 102.75,27.32
  Top 0.508: R1.2 140.8,38.8 U$16.5 141.95,36.45 v142,36.5 | C6.1 104.62,26
  Top 1.016: Q25.1 157.11,29.11 v157,29
  Route2 1.016: v157,29 143,29 | 143,29 131.02,17.02 111.98,17.02 104.62,24.38 v104.62,25.48 | 143,29 142,30 v142,36.5
N$36  (via drill 0.4)
  Top 0.406: R21.1 125.5,23.25 | 125.5,23.25 124.66,23.25 U$8.4 | 125.5,23.25 125.5,26.5 124.9,27.1 122.1,27.1 121.78,26.78 C4.1 121.8,25.77 121.8,28.1 v121.6,28.3 | C6.2 105.97,29.88 v113.75,29.88
  Top 0.508: U$16.4 141,34.35 R2.1
  Top 1.016: Q26.1 157,42.43 v157,41 | v139.5,32 R2.1
  Route2 0.406: v121.6,28.3 120.03,29.88 v113.75,29.88
  Route2 1.016: v139.5,32 136.5,29 122.3,29 v121.6,28.3
  Route15 1.016: v139.5,32 139.5,36.5 142.14,39.14 155.14,39.14 v157,41
N$37
  Top 0.305: U$7.6 116.05,23.8 116.5,24.25 118.25,24.25 119,23.5 119,22.25 119.25,22 123.25,22 123.5,22.25 U$8.5
N$38
  Top 0.305: U$8.2 123.5,21.25 123.26,21.49 119.01,21.49 117.95,22.55 U$7.4
N$39
  Top 0.508: R25.1 74.8,29.7 U$4.1 73.95,32.05 73,33 72.61,33 72.6,32.98 69.03,32.98 VR3.1
  Top 1.016: VR3.2 VR3.1
N$40  (via drill 3.2)
  other vias: 177.5,7
N$41  (via drill 3.2)
  other vias: 35,7
N$42
  Top 0.508: U$6.6 96.45,40.95 R37.2 96.5,39 100.42,39 C1.2
N$43  (via drill 0.4)
  Top 0.406: CR5.ANODE v107.62,25.75 | D5.A 88.69,17.65 v88.75,17.71 88.75,18.25 90.2,19.7 U$12.3
  Route2 0.406: v107.62,25.75 106.62,26.75 102.62,26.75 100.38,24.5 95.75,24.5 88.96,17.71 v88.75,17.71
N$44  (via drill 0.4)
  Top 0.406: D6.A 85.9,17.65 88.3,20.05 U$12.1 88.3,20.5 | v107.75,28.38 107.72,28.4 CR6.ANODE
  Top 0.508: v87.35,22 87.75,22 88.3,21.45 88.3,20.5
  Route2 0.406: v87.35,22 93.22,27.88 107.25,27.88 v107.75,28.38
N$45  (via drill 0.4)
  Top 0.508: D7.C 124.45,20.1 U$8.3 124.5,20.5 v124.5,21.5 | CR5.CATHODE v112.25,25.75
  Route2 0.508: v112.25,25.75 115.75,25.75 120,21.5 v124.5,21.5
N$46  (via drill 0.4)
  Top 0.406: v112.14,28.61 110.89,28.61 CR6.CATHODE
  Top 0.508: U$8.1 122.55,19.2 D8.C 124,17.75 v124,19
  Route2 0.406: 112.19,28.56 v112.14,28.61
  Route2 0.508: v124,19 125.75,20.75 125.75,22 119.19,28.56 112.19,28.56
N$47
  Top 0.508: U$4.3 74.8,36.3 R26.2
  Top 1.016: R26.2 R27.1
N$48
  Top 0.508: R27.2 69.54,37.04 VR3.3
N$49  (via drill 3.2)
  other vias: 46.5,7
N$50  (via drill 0.4)
  Top 0.406: R24.1 124,24.75 123.5,24.25 122.75,24.25 122.55,24.05 U$8.6 122.32,23.28 C5.1 120.3,23.33 v120.3,24.65 | C7.2 100.88,29.72 v101.25,30.09
  Top 0.508: U$4.4 72,34.15 R26.1
  Top 1.016: Q22.1 55.39,38.89 v55.5,39 | v73,36.5 R26.1
  Route2 0.406: v101.25,30.09 107.91,30.09 110.75,27.25 117.7,27.25 v120.3,24.65
  Route2 1.016: v101.25,30.09 97.34,34 81.5,34 79,36.5 v73,36.5
  Route15 1.016: v55.5,39 56.5,38 56.5,33.5 61.25,28.75 67.75,28.75 73,34 v73,36.5
N$51
  Top 0.508: U$16.3 138.2,32.2 R2.2 R5.1
N$52  (via drill 3.2)
  other vias: 18,7
N$53
  Top 0.508: U$13.5 R44.1
N$54  (via drill 0.4)
  Top 0.508: CR10.CATHODE v60,21.5
  Top 1.016: C8.1 v64,31.25 D9.C | CR10.CATHODE 58.5,21.48 R28.1 R32.2
  Route2 0.508: v60,21.5 60,27.25 v64,31.25
N$55  (via drill 3.2)
  other vias: 18,61
N$56  (via drill 3.2)
  other vias: 35,61
N$57
  Top 0.508: Q21.2 50.31,24.19 53.31,24.19
  Top 1.016: Q23.3 55.39,22.11 53.31,24.19 Q21.P$57
  Bottom 0.508: Q21.2 50.31,24.19 Q21.P$57
  Bottom 1.016: Q21.2 Q21.P$18 | Q21.P$17 48.5,28.5 46.99,28.5 Q21.2 | Q21.2 46.5,29.04 Q21.P$25 | Q21.2 47.77,29.27 Q21.P$26 | Q21.2 Q21.P$19
  pour Route2 (no thermals): 40.5,33 52.5,33 52.5,23 40.5,23
  pour Route15 (no thermals): 40.5,33 52.5,33 52.5,23 40.5,23
N$58
  Top 0.508: Q22.4 51,44.5 52.5,44.5
  Top 1.016: Q24.3 55.39,53.89 53.5,52 53.5,45.49 52.5,44.5 Q22.P$63
  Bottom 0.508: Q22.4 50.31,43.81 Q22.P$63
  pour Route15 (no thermals): 40.5,45 52.5,45 52.5,35 40.5,35
  pour Route2 (no thermals): 40.5,45 52.5,45 52.5,35 40.5,35
N$59
  Top 1.016: Q23.1 57.43,15.5 R32.1
N$60
  Top 1.016: Q24.1 55.39,47.61 57,46 R33.1
N$61  (via drill 0.4)
  Top 1.016: R6.1 151.47,15.53 CR7.ANODE 151.5,18.52 R22.2 | D3.C 149,31.5 | 149,31.5 C9.1 | v150.5,31.25 149.25,31.25 149,31.5
  Bottom 1.016: R22.2 151.5,30.25 v150.5,31.25
  other vias: 151.5,21.5
N$62
  Top 1.016: Q21.3 55.39,29.81 R34.1
N$63
  Top 1.016: Q22.3 59.76,42.54 R35.2
N$64  (via drill 0.4)
  Top 1.016: R13.1 151.47,46.02 v151.47,47 CR8.ANODE 151.5,49.02 R30.2 | D4.A v149,36.5 C9.2
  Bottom 1.016: v151.47,47 151.47,38.98 v149,36.5
N$65
  Top 0.508: Q25.2 164.73,29.27 Q25.P$14
  Top 1.016: Q27.3 159,15.35 159,22.5 Q25.P$63
  Bottom 0.508: Q25.2 Q25.P$17 Q25.P$13
  pour Route2 (no thermals): 160,33 172,33 172,23 160,23
  pour Route15 (no thermals): 160,33 172,33 172,23 160,23
N$66
  Top 0.508: Q26.4 164,42 163.5,42 164.04,42.54 Q26.P$3
  Top 1.016: Q28.3 157.11,48.39 158,47.5 158,46 160.19,43.81 Q26.P$57
  Bottom 0.508: Q26.4 163.46,42.54 Q26.P$2
  pour Route2 (no thermals): 160,45 172,45 172,35 160,35
  pour Route15 (no thermals): 160,45 172,45 172,35 160,35
N$67
  Top 1.016: Q27.1 157.11,20.39 156,21.5 R22.1
N$68
  Top 1.016: Q28.1 157.11,53.61 155.5,52 R30.1
N$69
  Top 1.016: R36.2 157.11,38.19 Q26.3
N$70
  Top 1.016: Q25.3 153.26,25.46 R31.1
N$71
  Top 0.508: VR2.1 143.96,35.5 140,35.5 139,36.5 138.25,36.5 U$16.1 138.2,38.8 R1.1
  Top 1.016: VR2.1 VR2.2
N$72
  Top 1.016: R5.2 142,30 143.54,30 VR2.3
N$73  (via drill 0.4)
  Top 0.305: U$6.1 96.45,44.95 96.05,44.55 94.85,44.55 94.5,44.9 94.5,45.49
  Top 0.406: U$6.1 97.2,45.55 v97.24,45.5 | U$6.3 94.5,45.49
  Top 0.508: D11.C v98.75,41.15 CR3.CATHODE
  Route2 0.406: v97.24,45.5 98.75,43.99 v98.75,41.15
N$74  (via drill 3.2)
  other vias: 166,61
N$75
  Top 0.305: U$3.2 101.9,43.85 101.81,43.94 101.48,43.94 101.48,43.95 95.75,43.95 95.5,43.7 U$6.5
N$76
  Top 0.406: R41.1 103,45.4 U$3.4
  Top 0.508: U$3.4 102.85,47.92 C10.1 C12.2 111.55,46.05 U$15.1
N$77
  Top 0.305: U$15.5 110.6,41.5 112,41.5 112.25,41.75 112.25,43.25 112.8,43.8 116.6,43.8 117,43.4 U$9.2
N$78  (via drill 3.2)
  other vias: 177,61
N$79
  Top 0.305: U$9.5 117,44.75 116.61,44.36 110.6,44.36 U$15.2
N$80
  Top 0.508: U$9.4 118.75,44.59 118.75,40.5 118.1,39.85 R39.1 117,39.75 116.25,39.75 115.25,38.75 112.28,38.75 C11.1
N$81
  Top 0.406: R42.2 91.9,40.5 92,40.6
  Top 0.508: 92,40.6 U$14.5
N$82
  Top 1.016: R46.2 SJ2.P$1
N$83  (via drill 3.2)
  other vias: 193.5,7
N$84  (via drill 3.2)
  other vias: 166,7
N$87  (via drill 3.2)
  other vias: 46.5,61
N$88  (via drill 3.2)
  other vias: 193,61
N$89
  Top 1.016: LED3.C 151.5,12.25 R49.2
N$90
  Top 1.016: R50.1 151.25,57.75 LED4.A
N$91
  Top 0.406: R51.1 LED5.C
N$92
  Top 0.406: LED6.A R52.1
N$93
  Top 1.016: R54.1 61.5,55.25 LED2.A
N$94
  Top 1.016: LED1.C 58.5,12.25 R53.2
N$106
  Top 0.61: U$32.5 16.5,20.85 16.5,20.5 | 16.5,20.5 U$32.2 | U$29.ANODE 19.5,20.48 19.5,20.5 16.5,20.5
N$107
  Top 0.508: U$27.1 22.75,24.55 C64.1
  Top 0.61: C64.1 19.08,24.55 C65.1 18.33,23.8 17.5,23.8 | D22.C 17.5,23.8 | U$32.4 17.5,21.85 17.5,23.8
N$108
  Top 0.61: R68.1 D22.A 15.67,27.03 C65.2 19.08,26.45 C64.2
N$109
  Top 0.61: R68.2 16.65,32.5 Q1.E
N$110
  Top 0.61: Q2.E 17.55,37.05 17,36.5 17,35.5 16.5,35 R70.1
N$111
  Top 0.61: R70.2 D23.C 18.33,40.3 C66.1 19.08,41.05 C67.1
N$112
  Top 0.61: C67.2 19.08,42.95 C66.2 15.67,43.53 D23.A 16.05,44.25 U$31.4
  Top 0.813: C67.2 21.05,43 23,43 24.2,44.2 U$28.1
N$113
  Top 0.61: U$31.5 17,46.65 17,47 | 17,47 U$31.2 | U$30.CATHODE 19.48,47 17,47
N$114
  Top 0.61: Q2.B 21.4,38.1 R71.2
N$115
  Top 0.61: Q1.B 20.35,32.5 R72.2
N$116
  Top 0.508: IC5.2 30.36,27.86 29.5,27 R73.2 R74.1 32.05,23.7 C70.2
N$119
  Top 0.61: IC6.6 24.89,40.88 23.5,39.5 23.5,37 23,36.5 22.5,36.5 21.5,35.5 R71.1
N$120
  Top 0.508: IC6.2 30.39,39.62 29.5,40.5 R76.1 R75.2 32,46.45 C71.1
N$121
  Top 0.61: IC5.3 33.81,29.14 C73.1 C93.1 33.75,33.05 32.94,33.86 IC4.6
N$122
  Top 0.508: IC5.6 25.36,29.14 24.94,29.56 21.56,29.56 R72.1
N$123
  Top 0.61: U$31.3 16.05,49.95 R69.1
N$124
  Top 0.61: U$31.1 17.95,49.7 D21.A
N$125
  Top 0.61: U$32.3 17.45,18.05 R67.2
N$126
  Top 0.61: U$32.1 15.55,17.3 D20.C
N$127
  Top 0.508: U$37.ANODE 197.5,20 196,21.5 193.5,21.5 | 193.5,21.5 U$40.2 | U$40.5 192.55,22.45 193.5,21.5
N$128
  Top 0.508: U$40.4 194.45,24.42 C89.1 | C89.1 192.5,24.97 | 192.5,24.97 192.17,24.97 D29.C | C88.1 195.58,25.55 C89.1 | U$35.1 187.8,21.3 191.5,25 192.47,25 192.5,24.97
N$129
  Top 0.508: D29.A 192.17,28.03 C89.2 195.58,27.45 C88.2 197.5,30 R80.1
N$130
  Top 0.508: R80.2 195.95,31.45 Q3.E
N$131
  Top 0.508: R82.1 197.9,36.4 Q4.E
N$132
  Top 0.508: D30.C 192.17,41.47 C90.1 195.58,42.05 C91.1 197.5,40 R82.2
N$133
  Top 0.508: C91.2 195.58,43.95 C90.2 192.5,44.53 | 192.5,44.53 192.17,44.53 D30.A | 192.5,44.53 192.55,44.58 U$39.4 185,46.7 U$36.1
N$134
  Top 0.508: U$39.5 193.5,47.65 193.5,48 | 193.5,48 U$39.2 | U$38.CATHODE 197.5,48.5 197,48 193.5,48
N$135
  Top 0.508: Q4.B 192.4,36.4 R83.2
N$136
  Top 0.508: Q3.B 192,32.95 R84.2
N$137
  Top 0.508: R85.2 183.5,24.25 | 183.5,24.25 R86.1 182.5,22.3 C97.2 | IC8.2 182.87,29.14 183.5,28.5 183.5,24.25
N$140
  Top 0.508: R83.1 191.5,39 190.88,39.62 IC9.6
N$141
  Top 0.508: IC9.2 182.88,40.88 183.5,41.5 183.5,44.5 | 183.5,44.5 R87.2 181.5,45.95 C98.1 | 183.5,44.5 R88.1
N$142
  Top 0.508: IC7.6 179.31,35.13 C120.1 178.95,35.5 177.5,35.5 177,35 177,28 177.45,27.55 C100.1 179.31,27.86 IC8.3
N$143
  Top 0.508: IC8.6 189.37,27.86 191.5,30 R84.1
N$144
  Top 0.508: U$39.3 192.55,51.05 R81.1
N$145
  Top 0.508: U$39.1 194.45,49.7 D28.A
N$146
  Top 0.508: U$40.3 194.45,20.05 R79.2
N$147
  Top 0.508: U$40.1 192.55,18.7 D27.C
OUT+  (via drill 0.4)
  Top 0.508: R48.1 107.75,34.22 C14.2 108.25,34.25 111,37 R3.1
  Top 1.016: R3.1 v110,37 | D3.A R31.2 TP2.TP R36.1 153,37.2 D4.C
  Route2 1.016: v110,37 111,38 149.5,38 153,34.5 TP2.TP
OUT-  (via drill 0.4)
  Top 0.508: R4.2 101.5,37 104.25,34.25 C13.2 104.75,34.22 R47.1
  Top 1.016: v102.5,37 R4.2 | D10.C 60,37.2 R35.1 TP1.TP R34.2 D9.A
  Route2 1.016: TP1.TP 60,38.5 101,38.5 v102.5,37
V1+  (via drill 0.4)
  Top 0.508: Q27.2 Q27.P$17 Q27.P$1 | C99.1 188.71,33.84 188.06,33.84 188.04,33.86 IC7.2 185.63,33.86 184.5,35 | C121.1 188.59,29.14 IC8.7 185.37,29.14 v184.5,30 184.5,35 | R88.2 185.5,43 185.4,43 184.5,42.1 184.5,35 | v184.5,19 U$35.3
  Top 0.61: 180,21.7 C97.1
  Top 1.016: CR7.CATHODE 154.53,15.53 R6.2 | R6.2 154.5,12.75 LED3.A | C30.+ v145,9 | C32.+ 147,20 | 147,20 v145,20 | C25.1 146.53,25.53 146.5,25.5 146.5,20.5 147,20 | R6.2 v156,15.5 | U$35.3 181,19 180,20 | 180,20 180,21.7 180,23.75 R86.2 | 180,20 179.7,20 D32.A 171.09,18.3 Q27.P$51
  Route2 0.508: v184.5,30 v184.5,19
  Bottom 0.508: Q27.2 Q27.P$18 Q27.P$2
  pour Route2 (no thermals): 160,21 172,21 172,11 160,11
  pour Route15 (no thermals): 160,21 172,21 172,11 160,11
  pour Route15 (isolate 0.61, rank 2, no thermals): 134.5,22 174.5,22 174.5,-2 134.5,-2
V1-  (via drill 0.4)
  Top 0.508: Q28.4 165.76,52.23 Q28.P$10 | C119.2 179.71,38.34 IC9.4
  Top 0.61: C33.- v144.5,59 | C31.- 146.5,48 v144.5,48 | LED4.C v153.5,55
  Top 1.016: CR8.CATHODE 154.5,48.98 154.5,47.5 | 154.5,47.5 R13.2 | 154.5,47.5 v156,47.5 | C26.2 146.5,40.53 146.5,48 | D31.C 178.55,50.15 C98.2 178.5,46.95 R87.1 177.5,44.5 177,44 177,39.5 177.45,39.05 C119.2 | U$36.3 186.8,49 184.3,51.5 179.3,51.5 178.5,50.7 D31.C | D31.C 170.88,50.7 Q28.P$54
  Bottom 0.508: Q28.4 Q28.P$17 Q28.P$57
  pour Route2 (no thermals): 160,57 172,57 172,47 160,47
  pour Route15 (no thermals): 160,57 172,57 172,47 160,47
  pour Route15 (isolate 0.61, rank 2, no thermals): 134.5,67.5 174,67.5 174,46 134.5,46
V2+  (via drill 0.4)
  Top 0.508: 65,10.5 65.75,9.75 C21.+ | Q23.2 Q23.P$15 | C94.1 24.09,27.86 IC5.7 27.36,27.86 28.5,29 | R76.2 28.5,42.5 28.5,36 | 28.5,36 27.64,35.13 IC4.2 | 28.5,36 28.5,29 | 28.5,29 28.5,26 28,25.5 28,22.5 31,19.5 33.95,19.5
  Top 0.61: IC4.2 24.18,35.13 C72.1
  Top 1.016: R28.2 61.52,18.52 CR10.ANODE 62.52,20.5 C23.+ 67.5,20.5 v68.5,21.5 | v68.5,10.5 65,10.5 63.75,10.5 LED1.A | C27.1 66.47,26.03 v66.5,26 | R74.2 34.5,22.3 C70.1 33.95,19.5 33.95,18.25 D25.A | D25.A 41.12,17.8 Q23.P$54 | U$27.3 26.45,16.25 31.95,16.25 D25.A
  Route15 1.016: v66.5,26 68.5,24 v68.5,21.5
  Bottom 0.508: Q23.2 50.31,19.81 Q23.P$41
  pour Route2 (no thermals): 40.5,21 52.5,21 52.5,11 40.5,11
  pour Route15 (no thermals): 40.5,21 52.5,21 52.5,11 40.5,11
  pour Route15 (isolate 0.61, rank 2, no thermals): 79,22 79,-0.5 38,-0.5 38,22
V2-  (via drill 0.4)
  Top 0.508: Q24.4 Q24.P$16 | R75.1 35,41.95 C92.2
  Top 0.61: IC6.4 32.8,42.16 C92.2
  Top 1.016: CR9.CATHODE 61.5,51.98 R29.2 62.5,48 C24.- 66.5,48 | 66.5,48 v68.5,48 | C22.- v68.5,59 | LED2.C 57.25,56 52.01,56 Q24.P$63 | U$28.3 29.5,49.7 D24.C | D24.C 34.45,48.75 C71.2 35,46.45 R75.1 | D24.C 33.76,49.96 41.16,49.96 Q24.P$51 | C28.2 66.47,47.97 66.5,48
  Bottom 0.508: Q24.4 50.31,55.81 Q24.P$63
  pour Route2 (no thermals): 40.5,57 52.5,57 52.5,47 40.5,47
  pour Route15 (no thermals): 40.5,57 52.5,57 52.5,47 40.5,47
  pour Route15 (isolate 0.61, rank 2, no thermals): 38,68 79,68 79,46 38,46
V+REG  (via drill 0.4)
  Top 0.406: R38.1 v87,42.5 | v86,5 LED5.A
  Top 0.508: R14.1 v88.8,35.7 | R9.1 97.25,14.25 | 97.25,14.25 v97.25,13.1 | R10.1 97.05,14.45 97.25,14.25 | C15.1 C16.1 85.72,35.42 v86,35.7
  Top 0.61: CR1.ANODE v100.05,13.1
  Top 0.813: R42.1 v91.9,35.7 | R37.1 v95.5,35.75 | CR3.ANODE v98.75,35.75
  Top 1.016: U$19.P$3 103.85,56 v97.5,56 96.25,56 C20.+
  Route15 0.406: v86,5 86,12.7 86.4,13.1
  Route15 1.016: 84.5,35.7 84.5,15 86.4,13.1 v97.25,13.1 v100.05,13.1 | v98.75,35.75 v95.5,35.75 95.45,35.7 v91.9,35.7 v88.8,35.7 v86,35.7 84.5,35.7 | 84.5,35.7 84.5,40 v87,42.5 87,49 94,56 v97.5,56
V-REG  (via drill 0.4)
  Top 0.406: v125,5.5 LED6.C
  Top 0.508: v121.25,13.25 R11.2 | R12.2 116.05,14.45 v116.05,13.25 | CR2.CATHODE v113.5,13.3 | C17.2 C18.2 127.03,35.47 v127,35.5
  Top 0.61: v123.75,35.5 123.75,36.65 R15.2 | R40.2 v125.25,42.25
  Top 0.813: CR4.CATHODE 113.75,36.77 v113.75,35.5 | R39.2 117,36.75 v117,35.5 | R44.2 v120.5,35.5
  Top 1.016: U$19.P$5 109.15,56 v117,56 117.75,56 C19.-
  Route15 0.406: 125,13.25 v125,5.5
  Route15 1.016: v113.5,13.3 116,13.3 v116.05,13.25 v121.25,13.25 125,13.25 126.75,13.25 128.75,15.25 128.75,35.5 | 128.75,35.5 v127,35.5 v123.75,35.5 v120.5,35.5 v117,35.5 v113.75,35.5 | 128.75,35.5 128.75,38.75 v125.25,42.25 125.25,51.75 121,56 v117,56
VIN2+
  Top 1.016: U$33.P$3 10.35,20.4 C86.+
  Bottom 0.508: U$27.2 U$27.P$19 U$27.P$35
  pour Top (isolate 0.61, no thermals): 13,15 36.5,15 36.5,-0.5 8.5,-0.5 8.5,21.5 13,21.5
VIN2-
  Top 0.508: U$28.P$36 30.31,62.31 U$28.2 25.23,59.77 U$28.P$11
  Top 1.016: U$33.P$5 10.35,47.1 C87.-
  Bottom 0.508: U$28.2 U$28.P$18
  pour Top (isolate 0.61, no thermals): 8.5,67.5 36.5,67.5 36.5,52.5 13,52.5 13,45.5 8.5,45.5
VIN+
  Top 1.016: U$41.P$5 201.75,29.1 C113.+
  Bottom 0.508: U$35.2 U$35.P$19 U$35.P$9
  pour Top (isolate 0.61, no thermals): 175,15.5 200,15.5 200,21.5 205,21.5 205,-1 175,-1
VIN-
  Top 1.016: U$41.P$3 202.25,36.4 C114.-
  Bottom 0.508: U$36.2 U$36.P$17 U$36.P$1
  pour Top (isolate 0.61, no thermals): 175,53.5 200,53.5 200,44 206,44 206,68 175,68

## Text on the board
tPlace: 2sa2097 | 2sa2097 | V+ G V- | 10k | 10k | 150 | 150 | 9Z34 | 15ma | 33 | 9Z34 | 1k2 | 15ma | 0n3 | 0n3 | CRD = 0.56ma / Zener = 12V | 1ma | 33 | 1k2 | 5k | 10k | 10k | 200 | 200 | 10k | 10k | 100 | 10u | 1ma | 10u | S352 | S312 | K489 | K689 | 1u | S352 | S312 | 9Z34 | 0.47 | 562 | 0n3 | 0n3 | 1u | 0.47 | 9Z34 | 2k2 | 200 | 100 | 200 | 200 | 100 | 200 | 10 | 10 | 10k | 10k | 10 | 10 | 2k2 | HN4B06J | 75 | 1u | 500 | Output Bias | 2p | 2p | Output Bias | 500 | 1u | HN4B06J | 5k | 75k | 75k | 1u | 2k2 | 10 | 10 | 10 | 10 | 1u | 5k | 2k2 | 1u | 1u | 562 | V+ G V- | Z24 | 0.47 | 1u | 1u | 0.47 | Z24 | 10 | 1u | 1u | 10 | V+ G V- | 1ma | 10u | 3k9 | 18p | 18p | 3k9 | 10u | 10k | 10k | 10k | 10k | 15ma | 3k9 | 18p | 18p | 3k9 | 75 | 1ma | S352 | S352 | S312 | K489 | K689 | S352 | S312 | S312 | 1k2 | 15ma | IRF9Z34N | 150 | Z24 | 75 | 10 | 1k5 | 1k5 | 50 | 50 | 1k5 | 10 | 1k5 | 1k2 | Z24 | 150 | 2V on 1K5 | 10k | 10k | V+ | 10k | 10k | V- | 100 | 200 | Fully-Differential Amplifier | β24 | Offset | Input Bias